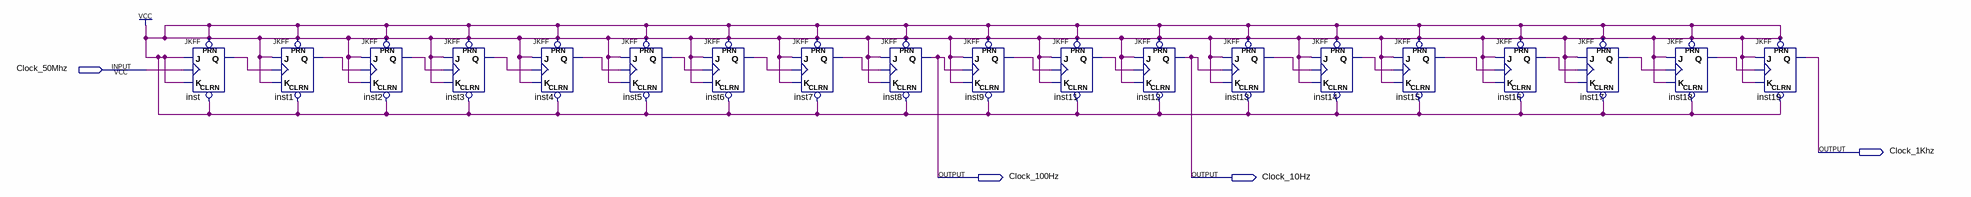
[diagram p0: schematic sheet]
// Quartus schematic Clock.bdf as structural Verilog: 19 symbols, 4 pins
module Clock (
  input  Clock_50Mhz,
  output Clock_1Khz,
  output Clock_100Hz,
  output Clock_10Hz
);

  wire inst1_q, inst2_q, inst3_q, inst4_q, inst5_q, inst6_q, inst7_q, inst9_q, inst11_q, inst13_q, inst14_q,
       inst15_q, inst16_q, inst17_q, inst18_q, inst_q;

  JKFF inst (.PRN(1'b1), .CLRN(1'b1), .K(1'b1), .J(1'b1), .CLK(Clock_50Mhz), .Q(inst_q));
  JKFF inst1 (.PRN(1'b1), .CLRN(1'b1), .K(1'b1), .J(1'b1), .CLK(inst_q), .Q(inst1_q));
  JKFF inst2 (.PRN(1'b1), .CLRN(1'b1), .K(1'b1), .J(1'b1), .CLK(inst1_q), .Q(inst2_q));
  JKFF inst3 (.PRN(1'b1), .CLRN(1'b1), .K(1'b1), .J(1'b1), .CLK(inst2_q), .Q(inst3_q));
  JKFF inst4 (.PRN(1'b1), .CLRN(1'b1), .K(1'b1), .J(1'b1), .CLK(inst3_q), .Q(inst4_q));
  JKFF inst5 (.PRN(1'b1), .CLRN(1'b1), .K(1'b1), .J(1'b1), .CLK(inst4_q), .Q(inst5_q));
  JKFF inst6 (.PRN(1'b1), .CLRN(1'b1), .K(1'b1), .J(1'b1), .CLK(inst5_q), .Q(inst6_q));
  JKFF inst7 (.PRN(1'b1), .CLRN(1'b1), .K(1'b1), .J(1'b1), .CLK(inst6_q), .Q(inst7_q));
  JKFF inst8 (.PRN(1'b1), .CLRN(1'b1), .K(1'b1), .J(1'b1), .CLK(inst7_q), .Q(Clock_100Hz));
  JKFF inst9 (.PRN(1'b1), .CLRN(1'b1), .K(1'b1), .J(1'b1), .CLK(Clock_100Hz), .Q(inst9_q));
  JKFF inst11 (.PRN(1'b1), .CLRN(1'b1), .K(1'b1), .J(1'b1), .CLK(inst9_q), .Q(inst11_q));
  JKFF inst12 (.PRN(1'b1), .CLRN(1'b1), .K(1'b1), .J(1'b1), .CLK(inst11_q), .Q(Clock_10Hz));
  JKFF inst13 (.PRN(1'b1), .CLRN(1'b1), .K(1'b1), .J(1'b1), .CLK(Clock_10Hz), .Q(inst13_q));
  JKFF inst14 (.PRN(1'b1), .CLRN(1'b1), .K(1'b1), .J(1'b1), .CLK(inst13_q), .Q(inst14_q));
  JKFF inst15 (.PRN(1'b1), .CLRN(1'b1), .K(1'b1), .J(1'b1), .CLK(inst14_q), .Q(inst15_q));
  JKFF inst16 (.PRN(1'b1), .CLRN(1'b1), .K(1'b1), .J(1'b1), .CLK(inst15_q), .Q(inst16_q));
  JKFF inst17 (.PRN(1'b1), .CLRN(1'b1), .K(1'b1), .J(1'b1), .CLK(inst16_q), .Q(inst17_q));
  JKFF inst18 (.PRN(1'b1), .CLRN(1'b1), .K(1'b1), .J(1'b1), .CLK(inst17_q), .Q(inst18_q));
  JKFF inst19 (.PRN(1'b1), .CLRN(1'b1), .K(1'b1), .J(1'b1), .CLK(inst18_q), .Q(Clock_1Khz));
endmodule
